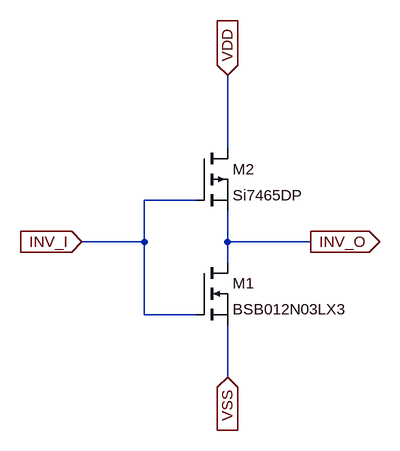
[diagram p0: schematic m_Inverter.asc]
m_Inverter.asc, the LTspice schematic file:
Version 4
SHEET 1 880 680
WIRE 240 -32 240 -144
WIRE 192 48 112 48
WIRE 112 112 112 48
WIRE 112 112 16 112
WIRE 240 112 240 64
WIRE 368 112 240 112
WIRE 240 144 240 112
WIRE 112 224 112 112
WIRE 192 224 112 224
WIRE 240 320 240 240
FLAG 16 112 INV_I
IOPIN 16 112 In
FLAG 368 112 INV_O
IOPIN 368 112 Out
FLAG 240 -144 VDD
IOPIN 240 -144 In
FLAG 240 320 VSS
IOPIN 240 320 In
SYMBOL nmos 192 144 R0
SYMATTR InstName M1
SYMATTR Value BSB012N03LX3
SYMBOL pmos 192 -32 R0
SYMATTR InstName M2
SYMATTR Value Si7465DP

The netlist it stands for:
* m_Inverter.asc
M1 INV_O INV_I VSS VSS BSB012N03LX3
M2 VDD INV_I INV_O INV_O Si7465DP
.model NMOS NMOS
.model PMOS PMOS
.lib standard.mos
.backanno
.end